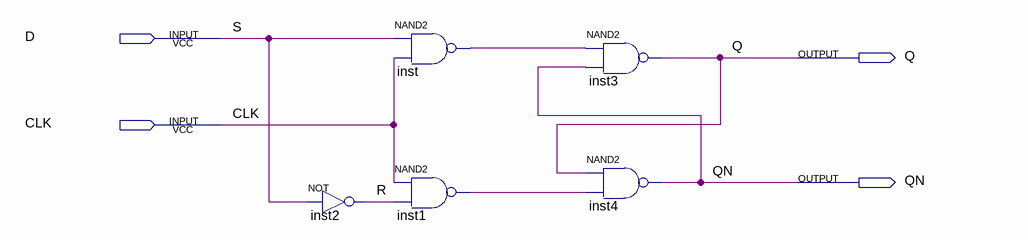
[diagram p0: schematic sheet]
// Quartus schematic My_Dlatch.bdf as structural Verilog: 5 symbols, 4 pins
module My_Dlatch (
  input  D,
  input  CLK,
  output Q,
  output QN
);

  wire inst1_out, inst_out, R;

  not inst2 (R, D);
  nand inst (inst_out, D, CLK);
  nand inst1 (inst1_out, CLK, R);
  nand inst3 (Q, inst_out, QN);
  nand inst4 (QN, Q, inst1_out);

  // Other names for the same wires on the sheet: S = D
endmodule
